# Altium schematic sheet [01] - CAPA.SchDoc
size A3; DocumentNumber: 1; SheetNumber: 1; SheetTotal: 6
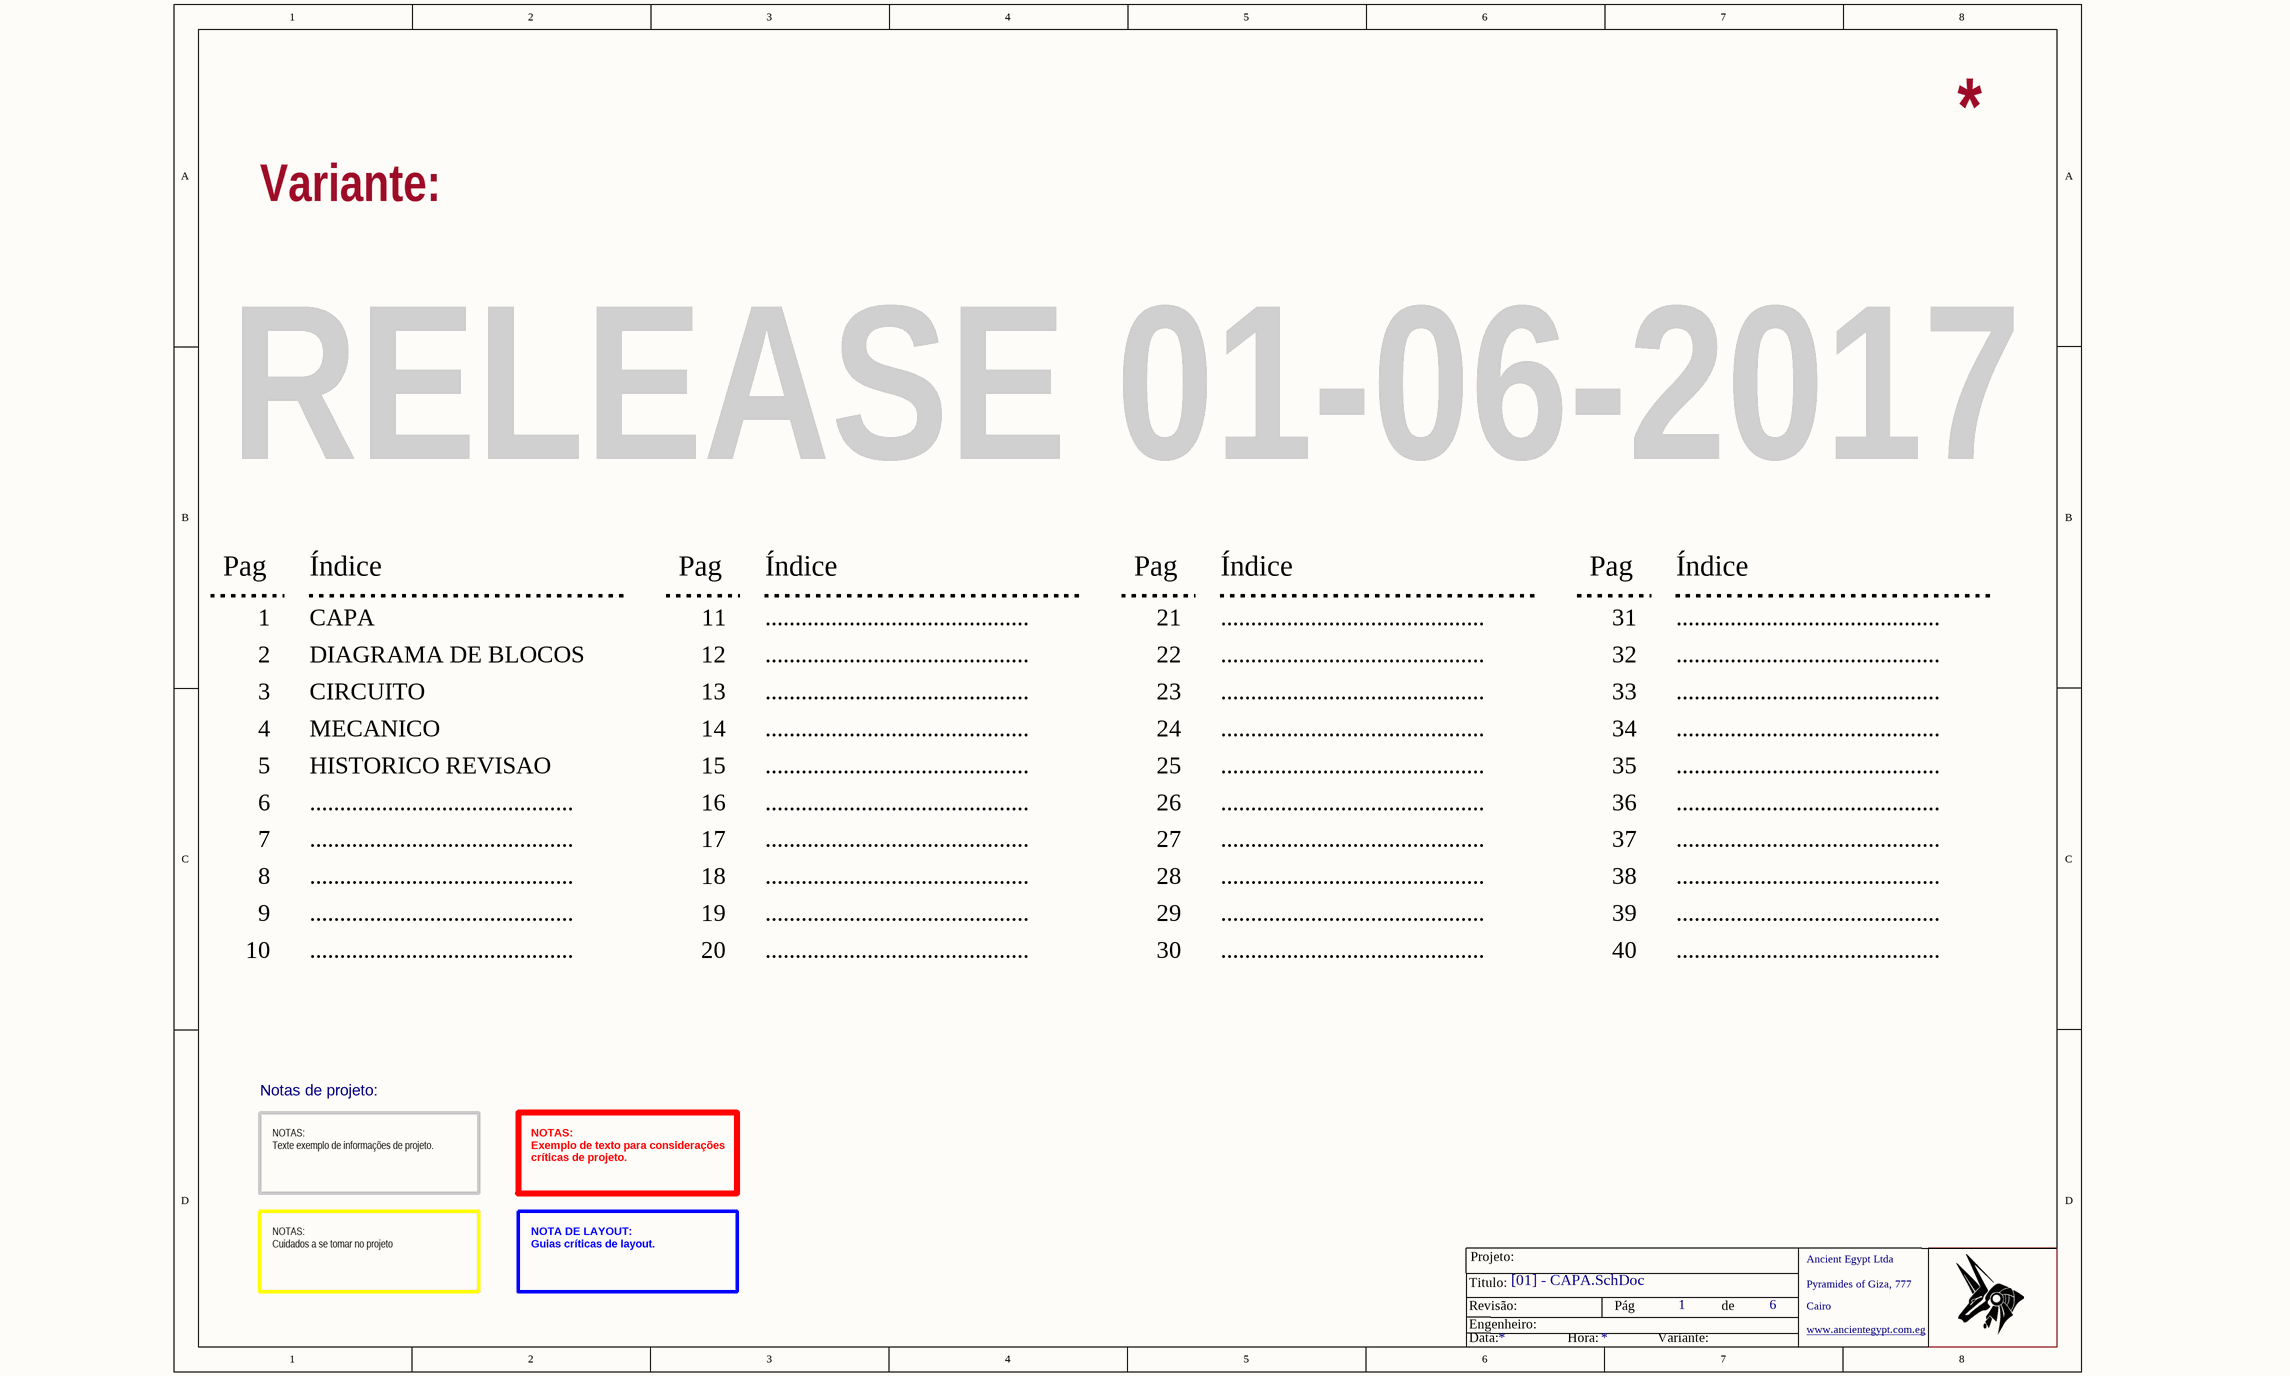
[diagram p0: [01] - CAPA.SchDoc]

## Notes on the sheet
- Variante:
- RELEASE 01-06-2017
- Pag
- Índice
- 1
- CAPA
- 11
- ............................................
- 21
- 31
- 2
- 3
- DIAGRAMA DE BLOCOS
- CIRCUITO
- 12
- 13
- 22
- 23
- 32
- 33
- 4
- 5
- MECANICO
- HISTORICO REVISAO
- 14
- 15
- 24
- 25
- 34
- 35
- 6
- 16
- 26
- 36
- 7
- 8
- 17
- 18
- 27
- 28
- 37
- 38
- 9
- 10
- 19
- 20
- 29
- 30
- 39
- 40
- Notas de projeto:
- NOTAS:
  Texte exemplo de informações de projeto.
- NOTAS:
  Exemplo de texto para considerações críticas de projeto.
- NOTAS:
  Cuidados a se tomar no projeto
- NOTA DE LAYOUT:
  Guias críticas de layout.
- Projeto:
- Ancient Egypt Ltda
- Revisão:
- Engenheiro:
- Titulo:
- Pág
- de
- Pyramides of Giza, 777
- Cairo
- www.ancientegypt.com.eg
- Data:
- Hora: